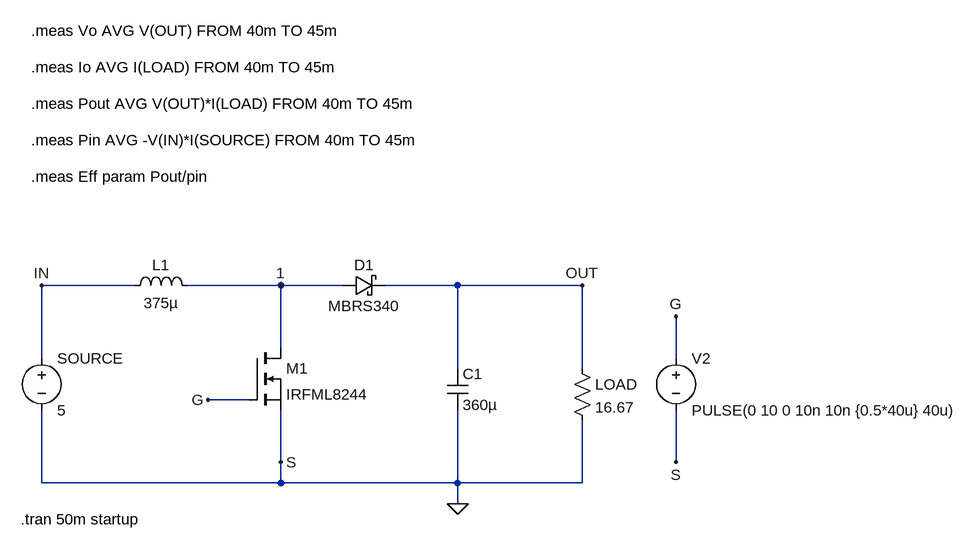
[diagram p0: schematic Boost.asc]
Boost.asc, the LTspice schematic file:
Version 4
SHEET 1 1904 796
WIRE -160 64 -304 64
WIRE 64 64 -80 64
WIRE 160 64 64 64
WIRE 336 64 224 64
WIRE 528 64 336 64
WIRE 64 160 64 64
WIRE -304 176 -304 64
WIRE 672 176 672 112
WIRE 336 192 336 64
WIRE 528 192 528 64
WIRE 16 240 -48 240
WIRE 64 336 64 256
WIRE 672 336 672 256
WIRE -304 368 -304 256
WIRE 64 368 64 336
WIRE 64 368 -304 368
WIRE 336 368 336 256
WIRE 336 368 64 368
WIRE 528 368 528 272
WIRE 528 368 336 368
WIRE 336 400 336 368
FLAG 336 400 0
FLAG 672 112 G
FLAG -48 240 G
FLAG 672 336 S
FLAG 64 336 S
FLAG 528 64 OUT
FLAG -304 64 IN
FLAG 64 64 1
SYMBOL cap 320 192 R0
SYMATTR InstName C1
SYMATTR Value 360µ
SYMBOL voltage -304 160 R0
WINDOW 123 0 0 Left 0
WINDOW 39 0 0 Left 0
SYMATTR InstName SOURCE
SYMATTR Value 5
SYMBOL voltage 672 160 R0
WINDOW 123 0 0 Left 0
WINDOW 39 0 0 Left 0
SYMATTR InstName V2
SYMATTR Value PULSE(0 10 0 10n 10n {0.5*40u} 40u)
SYMBOL res 512 176 R0
SYMATTR InstName LOAD
SYMATTR Value 16.67
SYMBOL nmos 16 160 R0
SYMATTR InstName M1
SYMATTR Value IRFML8244
SYMBOL ind -176 80 R270
WINDOW 0 32 56 VTop 2
WINDOW 3 5 56 VBottom 2
SYMATTR InstName L1
SYMATTR Value 375µ
SYMBOL schottky 160 80 R270
WINDOW 0 32 32 VTop 2
WINDOW 3 0 32 VBottom 2
SYMATTR InstName D1
SYMATTR Value MBRS340
SYMATTR Description Diode
SYMATTR Type diode
TEXT -336 424 Left 2 !.tran 50m startup
TEXT -320 -328 Left 2 !.meas Vo AVG V(OUT) FROM 40m TO 45m
TEXT -320 -272 Left 2 !.meas Io AVG I(LOAD) FROM 40m TO 45m
TEXT -320 -216 Left 2 !.meas Pout AVG V(OUT)*I(LOAD) FROM 40m TO 45m
TEXT -320 -160 Left 2 !.meas Pin AVG -V(IN)*I(SOURCE) FROM 40m TO 45m
TEXT -320 -104 Left 2 !.meas Eff param Pout/pin

The netlist it stands for:
* Boost.asc
C1 OUT 0 360µ
V§SOURCE IN 0 5
V2 G 0 PULSE(0 10 0 10n 10n {0.5*40u} 40u)
R§LOAD OUT 0 16.67
M1 1 G 0 0 IRFML8244
L1 IN 1 375µ
D1 1 OUT MBRS340
.model D D
.lib standard.dio
.model NMOS NMOS
.model PMOS PMOS
.lib standard.mos
.tran 50m startup
.meas Vo AVG V(OUT) FROM 40m TO 45m
.meas Io AVG I(LOAD) FROM 40m TO 45m
.meas Pout AVG V(OUT)*I(LOAD) FROM 40m TO 45m
.meas Pin AVG -V(IN)*I(SOURCE) FROM 40m TO 45m
.meas Eff param Pout/pin
.backanno
.end